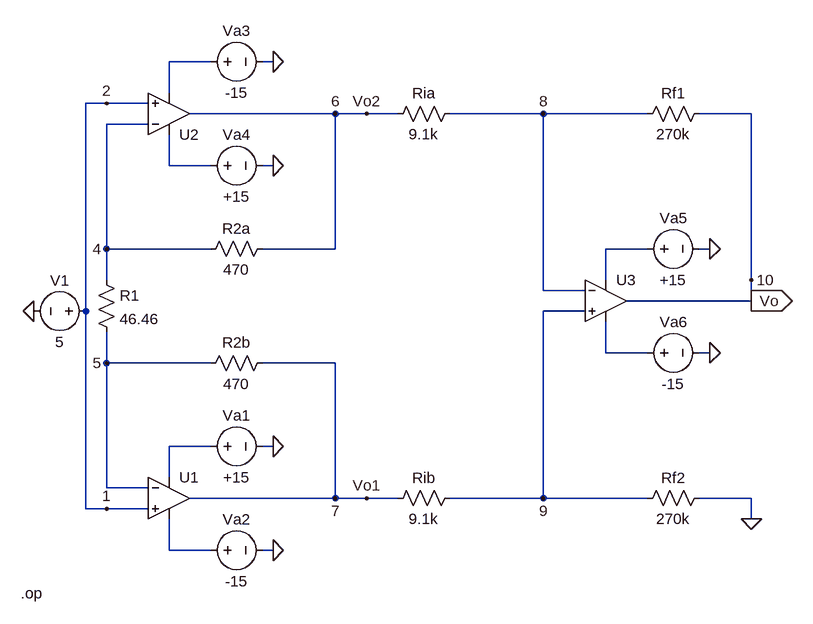
[diagram p0: schematic Run_1_A.asc]
Run_1_A.asc, the LTspice schematic file:
Version 4
SHEET 1 880 932
WIRE -416 96 -480 96
WIRE -320 96 -336 96
WIRE -480 144 -480 96
WIRE -576 160 -608 160
WIRE -512 160 -576 160
WIRE -224 176 -448 176
WIRE -176 176 -224 176
WIRE -128 176 -176 176
WIRE 96 176 -48 176
WIRE 256 176 96 176
WIRE 416 176 336 176
WIRE -512 192 -576 192
WIRE -480 256 -480 208
WIRE -416 256 -480 256
WIRE -320 256 -336 256
WIRE -576 384 -576 192
WIRE -416 384 -576 384
WIRE -224 384 -224 176
WIRE -224 384 -336 384
WIRE 256 384 192 384
WIRE 352 384 336 384
WIRE -576 432 -576 384
WIRE 192 432 192 384
WIRE 416 432 416 176
WIRE 96 448 96 176
WIRE 160 448 96 448
WIRE 416 464 416 432
WIRE 416 464 224 464
WIRE -608 480 -608 160
WIRE 160 480 96 480
WIRE 192 544 192 496
WIRE 256 544 192 544
WIRE 352 544 336 544
WIRE -576 560 -576 512
WIRE -416 560 -576 560
WIRE -224 560 -336 560
WIRE -416 688 -480 688
WIRE -320 688 -336 688
WIRE -480 736 -480 688
WIRE -576 752 -576 560
WIRE -512 752 -576 752
WIRE -224 768 -224 560
WIRE -224 768 -448 768
WIRE -176 768 -224 768
WIRE -128 768 -176 768
WIRE 96 768 96 480
WIRE 96 768 -48 768
WIRE 256 768 96 768
WIRE 416 768 336 768
WIRE -608 784 -608 480
WIRE -576 784 -608 784
WIRE -512 784 -576 784
WIRE 416 800 416 768
WIRE -480 848 -480 800
WIRE -416 848 -480 848
WIRE -320 848 -336 848
FLAG -320 256 0
FLAG -320 96 0
FLAG -320 848 0
FLAG -320 688 0
FLAG 352 544 0
FLAG 352 384 0
FLAG 416 800 0
FLAG -576 784 1
FLAG -576 160 2
FLAG -576 384 4
FLAG -576 560 5
FLAG 96 176 8
FLAG 96 768 9
FLAG 416 432 10
FLAG -224 176 6
FLAG -224 768 7
FLAG -176 176 Vo2
FLAG -176 768 Vo1
FLAG 416 464 Vo
IOPIN 416 464 Out
FLAG -688 480 0
SYMBOL voltage -432 96 R270
WINDOW 0 32 56 VTop 2
WINDOW 3 -32 56 VBottom 2
WINDOW 123 0 0 Left 0
WINDOW 39 0 0 Left 0
SYMATTR InstName Va3
SYMATTR Value -15
SYMBOL voltage -432 256 R270
WINDOW 0 32 56 VTop 2
WINDOW 3 -32 56 VBottom 2
WINDOW 123 0 0 Left 0
WINDOW 39 0 0 Left 0
SYMATTR InstName Va4
SYMATTR Value +15
SYMBOL res -592 416 R0
SYMATTR InstName R1
SYMATTR Value 46.46
SYMBOL res -32 160 R90
WINDOW 0 0 56 VBottom 2
WINDOW 3 32 56 VTop 2
SYMATTR InstName Ria
SYMATTR Value 9.1k
SYMBOL res -320 368 R90
WINDOW 0 0 56 VBottom 2
WINDOW 3 32 56 VTop 2
SYMATTR InstName R2a
SYMATTR Value 470
SYMBOL res -320 544 R90
WINDOW 0 0 56 VBottom 2
WINDOW 3 32 56 VTop 2
SYMATTR InstName R2b
SYMATTR Value 470
SYMBOL OpAmps\\UniversalOpamp2 -480 768 R0
SYMATTR InstName U1
SYMBOL voltage -432 688 R270
WINDOW 0 32 56 VTop 2
WINDOW 3 -32 56 VBottom 2
WINDOW 123 0 0 Left 0
WINDOW 39 0 0 Left 0
SYMATTR InstName Va1
SYMATTR Value +15
SYMBOL voltage -432 848 R270
WINDOW 0 32 56 VTop 2
WINDOW 3 -32 56 VBottom 2
WINDOW 123 0 0 Left 0
WINDOW 39 0 0 Left 0
SYMATTR InstName Va2
SYMATTR Value -15
SYMBOL res -32 752 R90
WINDOW 0 0 56 VBottom 2
WINDOW 3 32 56 VTop 2
SYMATTR InstName Rib
SYMATTR Value 9.1k
SYMBOL OpAmps\\UniversalOpamp2 192 464 R0
SYMATTR InstName U3
SYMBOL voltage 240 384 R270
WINDOW 0 32 56 VTop 2
WINDOW 3 -32 56 VBottom 2
WINDOW 123 0 0 Left 0
WINDOW 39 0 0 Left 0
SYMATTR InstName Va5
SYMATTR Value +15
SYMBOL voltage 240 544 R270
WINDOW 0 32 56 VTop 2
WINDOW 3 -32 56 VBottom 2
WINDOW 123 0 0 Left 0
WINDOW 39 0 0 Left 0
SYMATTR InstName Va6
SYMATTR Value -15
SYMBOL res 352 160 R90
WINDOW 0 0 56 VBottom 2
WINDOW 3 32 56 VTop 2
SYMATTR InstName Rf1
SYMATTR Value 270k
SYMBOL res 352 752 R90
WINDOW 0 0 56 VBottom 2
WINDOW 3 32 56 VTop 2
SYMATTR InstName Rf2
SYMATTR Value 270k
SYMBOL OpAmps\\UniversalOpamp2 -480 176 M180
SYMATTR InstName U2
SYMBOL voltage -592 480 R90
WINDOW 0 -32 56 VBottom 2
WINDOW 3 32 56 VTop 2
WINDOW 123 0 0 Left 0
WINDOW 39 0 0 Left 0
SYMATTR InstName V1
SYMATTR Value 5
TEXT -708 914 Left 2 !.op

The netlist it stands for:
* Run_1_A.asc
Va3 N001 0 -15
Va4 N002 0 +15
R1 4 5 46.46
Ria 8 Vo2 9.1k
R2a Vo2 4 470
R2b Vo1 5 470
XU1 2 5 N005 N006 Vo1 level.2 Avol=1Meg GBW=10Meg Slew=10Meg ilimit=25m rail=0 Vos=0 phimargin=45 en=0 enk=0 in=0 ink=0 Rin=500Meg  ; pins IN+ IN- V+ V- OUT
Va1 N005 0 +15
Va2 N006 0 -15
Rib 9 Vo1 9.1k
XU3 9 8 N003 N004 Vo level.2 Avol=1Meg GBW=10Meg Slew=10Meg ilimit=25m rail=0 Vos=0 phimargin=45 en=0 enk=0 in=0 ink=0 Rin=500Meg  ; pins IN+ IN- V+ V- OUT
Va5 N003 0 +15
Va6 N004 0 -15
Rf1 Vo 8 270k
Rf2 0 9 270k
XU2 2 4 N002 N001 Vo2 level.2 Avol=1Meg GBW=10Meg Slew=10Meg ilimit=25m rail=0 Vos=0 phimargin=45 en=0 enk=0 in=0 ink=0 Rin=500Meg  ; pins IN+ IN- V+ V- OUT
V1 2 0 5
.op
.lib UniversalOpamps2.sub
.backanno
.end